# Altium schematic sheet CarteTxCapteurDistance.SchDoc
size A4
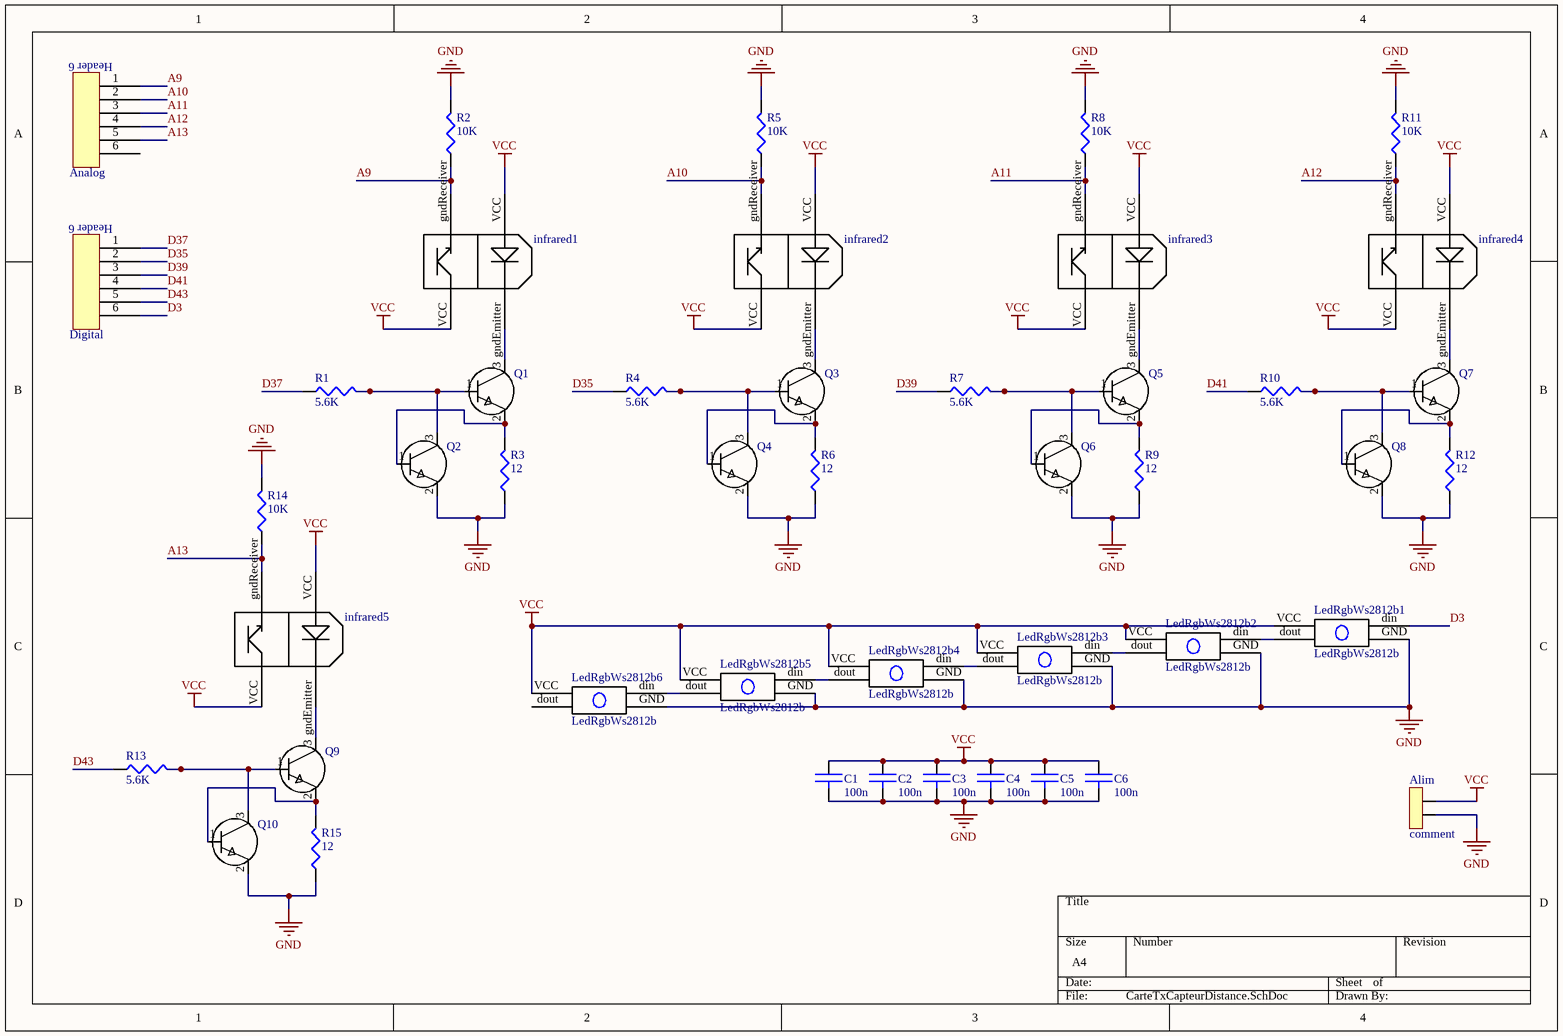
[diagram p0: CarteTxCapteurDistance.SchDoc]

## Parts
Alim  comment  [POWER2]
Analog  Analog  [HEADER6]
C1  value 100n  [0805]  (hidden comment: CAP)
C2  value 100n  [0805]  (hidden comment: CAP)
C3  value 100n  [0805]  (hidden comment: CAP)
C4  value 100n  [0805]  (hidden comment: CAP)
C5  value 100n  [0805]  (hidden comment: CAP)
C6  value 100n  [0805]  (hidden comment: CAP)
Digital  Digital  [HEADER6]
infrared1  infrared  [Infrared]  (value not drawn)
infrared2  infrared  [Infrared]  (value not drawn)
infrared3  infrared  [Infrared]  (value not drawn)
infrared4  infrared  [Infrared]  (value not drawn)
infrared5  infrared  [Infrared]  (value not drawn)
LedRgbWs2812b1  LedRgbWs2812b  [LedRgbWs2812b]
LedRgbWs2812b2  LedRgbWs2812b  [LedRgbWs2812b]
LedRgbWs2812b3  LedRgbWs2812b  [LedRgbWs2812b]
LedRgbWs2812b4  LedRgbWs2812b  [LedRgbWs2812b]
LedRgbWs2812b5  LedRgbWs2812b  [LedRgbWs2812b]
LedRgbWs2812b6  LedRgbWs2812b  [LedRgbWs2812b]
Q1  Q1  [BC817-40]  (value not drawn)
Q2  Q2  [BC817-40]  (value not drawn)
Q3  Q1  [BC817-40]  (value not drawn)
Q4  Q2  [BC817-40]  (value not drawn)
Q5  Q1  [BC817-40]  (value not drawn)
Q6  Q2  [BC817-40]  (value not drawn)
Q7  Q1  [BC817-40]  (value not drawn)
Q8  Q2  [BC817-40]  (value not drawn)
Q9  Q1  [BC817-40]  (value not drawn)
Q10  Q2  [BC817-40]  (value not drawn)
R1  value 5.6K  [0805]  (hidden comment: RES)
R2  value 10K  [0805]  (hidden comment: RES)
R3  value 12  [0805]  (hidden comment: RES)
R4  value 5.6K  [0805]  (hidden comment: RES)
R5  value 10K  [0805]  (hidden comment: RES)
R6  value 12  [0805]  (hidden comment: RES)
R7  value 5.6K  [0805]  (hidden comment: RES)
R8  value 10K  [0805]  (hidden comment: RES)
R9  value 12  [0805]  (hidden comment: RES)
R10  value 5.6K  [0805]  (hidden comment: RES)
R11  value 10K  [0805]  (hidden comment: RES)
R12  value 12  [0805]  (hidden comment: RES)
R13  value 5.6K  [0805]  (hidden comment: RES)
R14  value 10K  [0805]  (hidden comment: RES)
R15  value 12  [0805]  (hidden comment: RES)

## Nets
GND: Alim.2 C1.2 C2.2 C3.2 C4.2 C5.2 C6.2 LedRgbWs2812b1.GND LedRgbWs2812b2.GND LedRgbWs2812b3.GND LedRgbWs2812b4.GND LedRgbWs2812b5.GND LedRgbWs2812b6.GND Q2.2(Emi) Q4.2(Emi) Q6.2(Emi) Q8.2(Emi) Q10.2(Emi) R2.2 R3.1 R5.2 R6.1 R8.2 R9.1 R11.2 R12.1 R14.2 R15.1
VCC: Alim.1 C1.1 C2.1 C3.1 C4.1 C5.1 C6.1 infrared1.VCC infrared2.VCC infrared3.VCC infrared4.VCC infrared5.VCC LedRgbWs2812b1.VCC LedRgbWs2812b2.VCC LedRgbWs2812b3.VCC LedRgbWs2812b4.VCC LedRgbWs2812b5.VCC LedRgbWs2812b6.VCC
A9: Analog.1 infrared1.gndReceiver R2.1
A10: Analog.2 infrared2.gndReceiver R5.1
A11: Analog.3 infrared3.gndReceiver R8.1
A12: Analog.4 infrared4.gndReceiver R11.1
A13: Analog.5 infrared5.gndReceiver R14.1
D3: Digital.6 LedRgbWs2812b1.din
D35: Digital.2 R4.1
D37: Digital.1 R1.1
D39: Digital.3 R7.1
D41: Digital.4 R10.1
D43: Digital.5 R13.1
Netinfrared1_gndEmitter: infrared1.gndEmitter Q1.3(Co)
Netinfrared2_gndEmitter: infrared2.gndEmitter Q3.3(Co)
Netinfrared3_gndEmitter: infrared3.gndEmitter Q5.3(Co)
Netinfrared4_gndEmitter: infrared4.gndEmitter Q7.3(Co)
Netinfrared5_gndEmitter: infrared5.gndEmitter Q9.3(Co)
NetLedRgbWs2812b1_dout: LedRgbWs2812b1.dout LedRgbWs2812b2.din
NetLedRgbWs2812b2_dout: LedRgbWs2812b2.dout LedRgbWs2812b3.din
NetLedRgbWs2812b3_dout: LedRgbWs2812b3.dout LedRgbWs2812b4.din
NetLedRgbWs2812b4_dout: LedRgbWs2812b4.dout LedRgbWs2812b5.din
NetLedRgbWs2812b5_dout: LedRgbWs2812b5.dout LedRgbWs2812b6.din
NetQ1_1: Q1.1(Base) Q2.3(Co) R1.2
NetQ1_2: Q1.2(Emi) Q2.1(Base) R3.2
NetQ3_1: Q3.1(Base) Q4.3(Co) R4.2
NetQ3_2: Q3.2(Emi) Q4.1(Base) R6.2
NetQ5_1: Q5.1(Base) Q6.3(Co) R7.2
NetQ5_2: Q5.2(Emi) Q6.1(Base) R9.2
NetQ7_1: Q7.1(Base) Q8.3(Co) R10.2
NetQ7_2: Q7.2(Emi) Q8.1(Base) R12.2
NetQ9_1: Q9.1(Base) Q10.3(Co) R13.2
NetQ9_2: Q9.2(Emi) Q10.1(Base) R15.2

Not connected (* = marked no-connect by the designer): Analog 6; LedRgbWs2812b6 dout

## Notes on the sheet
- (in symbol HEADER6) Header 6

## Library data of the parts
Alim = POWER2: connecteur alim 2 pôles
Analog Digital = HEADER6
C1-C6 = CAP: capacité non polarisée
infrared1-infrared5 = RPR-359F
Q1-Q10 = Transistors
R1-R15 = RES: resistance